# Altium schematic sheet Main connector.SchDoc
size A3; SheetNumber: 6; SheetTotal: 7
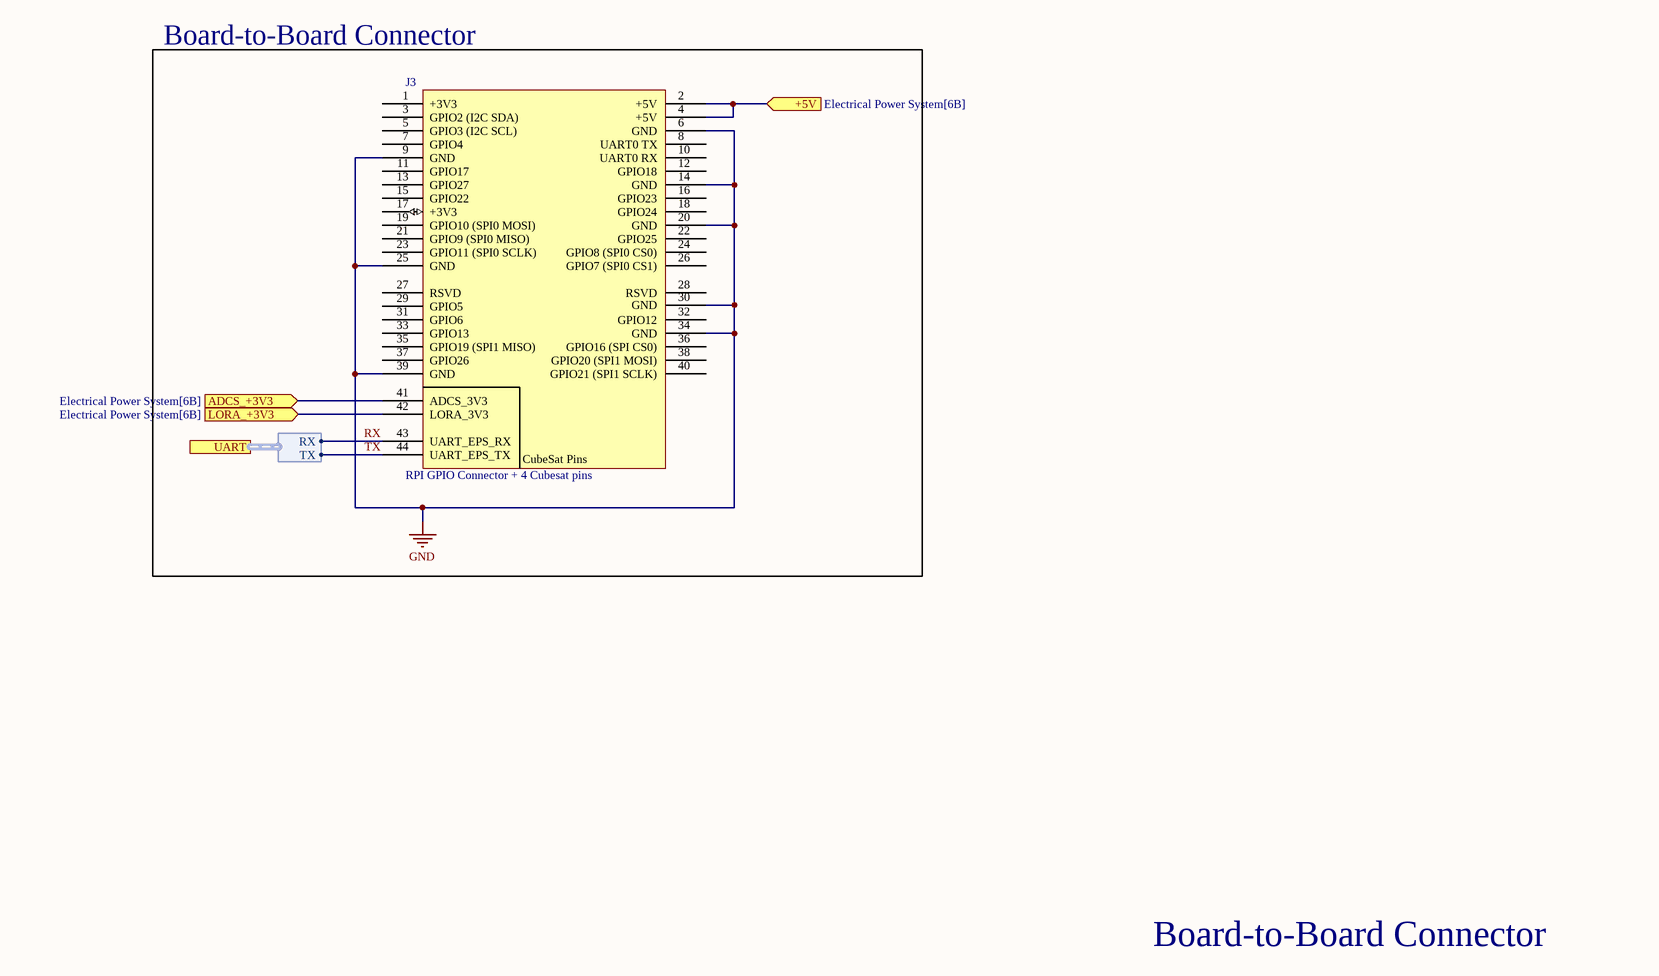
[diagram p0: Main connector.SchDoc]

## Parts
J3  RPI GPIO Connector + 4 Cubesat pins  [header 44 pin]

## Blocks framed on the sheet
Board-to-Board Connector: J3

## Ports
+5V (in, see Electrical Power System[6B]), ADCS_+3V3 (in, see Electrical Power System[6B]), LORA_+3V3 (in, see Electrical Power System[6B]), UART (harness *, see Electrical Power System[6B], uC[4B])

## Harnesses
*: RX, TX

## Nets
GND: J3.6(GND) J3.9(GND) J3.14(GND) J3.20(GND) J3.25(GND) J3.30(GND) J3.34(GND) J3.39(GND)
+5V: J3.2(+5V) J3.4(+5V) ; port +5V
ADCS_+3V3: J3.41(ADCS_3V3) ; port ADCS_+3V3
LORA_+3V3: J3.42(LORA_3V3) ; port LORA_+3V3
RX: J3.43(UART_EPS_RX) ; port UART.RX
TX: J3.44(UART_EPS_TX) ; port UART.TX

Not connected (* = marked no-connect by the designer): J3 1(+3V3) 3(GPIO2_(I2C_SDA)) 5(GPIO3_(I2C_SCL)) 7(GPIO4) 8(UART0_TX) 10(UART0_RX) 11(GPIO17) 12(GPIO18) 13(GPIO27) 15(GPIO22) 16(GPIO23) 17(+3V3) 18(GPIO24) 19(GPIO10_(SPI0_MOSI)) 21(GPIO9_(SPI0_MISO)) 22(GPIO25) 23(GPIO11_(SPI0_SCLK)) 24(GPIO8_(SPI0_CS0)) 26(GPIO7_(SPI0_CS1)) 27(RSVD) 28(RSVD) 29(GPIO5) 31(GPIO6) 32(GPIO12) 33(GPIO13) 35(GPIO19_(SPI1_MISO)) 36(GPIO16_(SPI_CS0)) 37(GPIO26) 38(GPIO20_(SPI1_MOSI)) 40(GPIO21_(SPI1_SCLK))

## Notes on the sheet
- Board-to-Board Connector
- (in symbol header 44 pin) CubeSat Pins

## Library data of the parts
J3 = header 44 pin